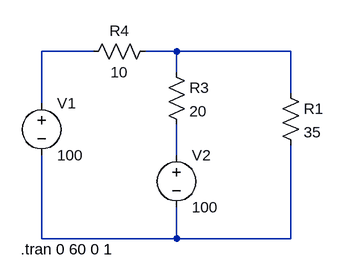
[diagram p0: schematic hinh1_1.asc]
hinh1_1.asc, the LTspice schematic file:
Version 4.1
SHEET 1 880 680
WIRE 16 -160 -64 -160
WIRE 144 -160 96 -160
WIRE 320 -160 144 -160
WIRE 144 -128 144 -160
WIRE 320 -96 320 -160
WIRE -64 -80 -64 -160
WIRE 144 0 144 -48
WIRE -64 128 -64 0
WIRE 144 128 144 80
WIRE 144 128 -64 128
WIRE 320 128 320 -16
WIRE 320 128 144 128
SYMBOL res 128 -144 R0
SYMATTR InstName R3
SYMATTR Value 20
SYMBOL voltage -64 -96 R0
WINDOW 123 0 0 Left 0
WINDOW 39 0 0 Left 0
SYMATTR InstName V1
SYMATTR Value 100
SYMBOL voltage 144 -16 R0
WINDOW 123 0 0 Left 0
WINDOW 39 0 0 Left 0
SYMATTR InstName V2
SYMATTR Value 100
SYMBOL res 112 -176 R90
WINDOW 0 0 56 VBottom 2
WINDOW 3 32 56 VTop 2
SYMATTR InstName R4
SYMATTR Value 10
SYMBOL res 304 -112 R0
SYMATTR InstName R1
SYMATTR Value 35
TEXT -96 144 Left 2 !.tran 0 60 0 1

The netlist it stands for:
* hinh1_1.asc
R3 N002 N003 20
V1 N001 N004 100
V2 N003 N004 100
R4 N002 N001 10
R1 N002 N004 35
.tran 0 60 0 1
.backanno
.end